# Altium schematic sheet CT Main.SchDoc
size A3
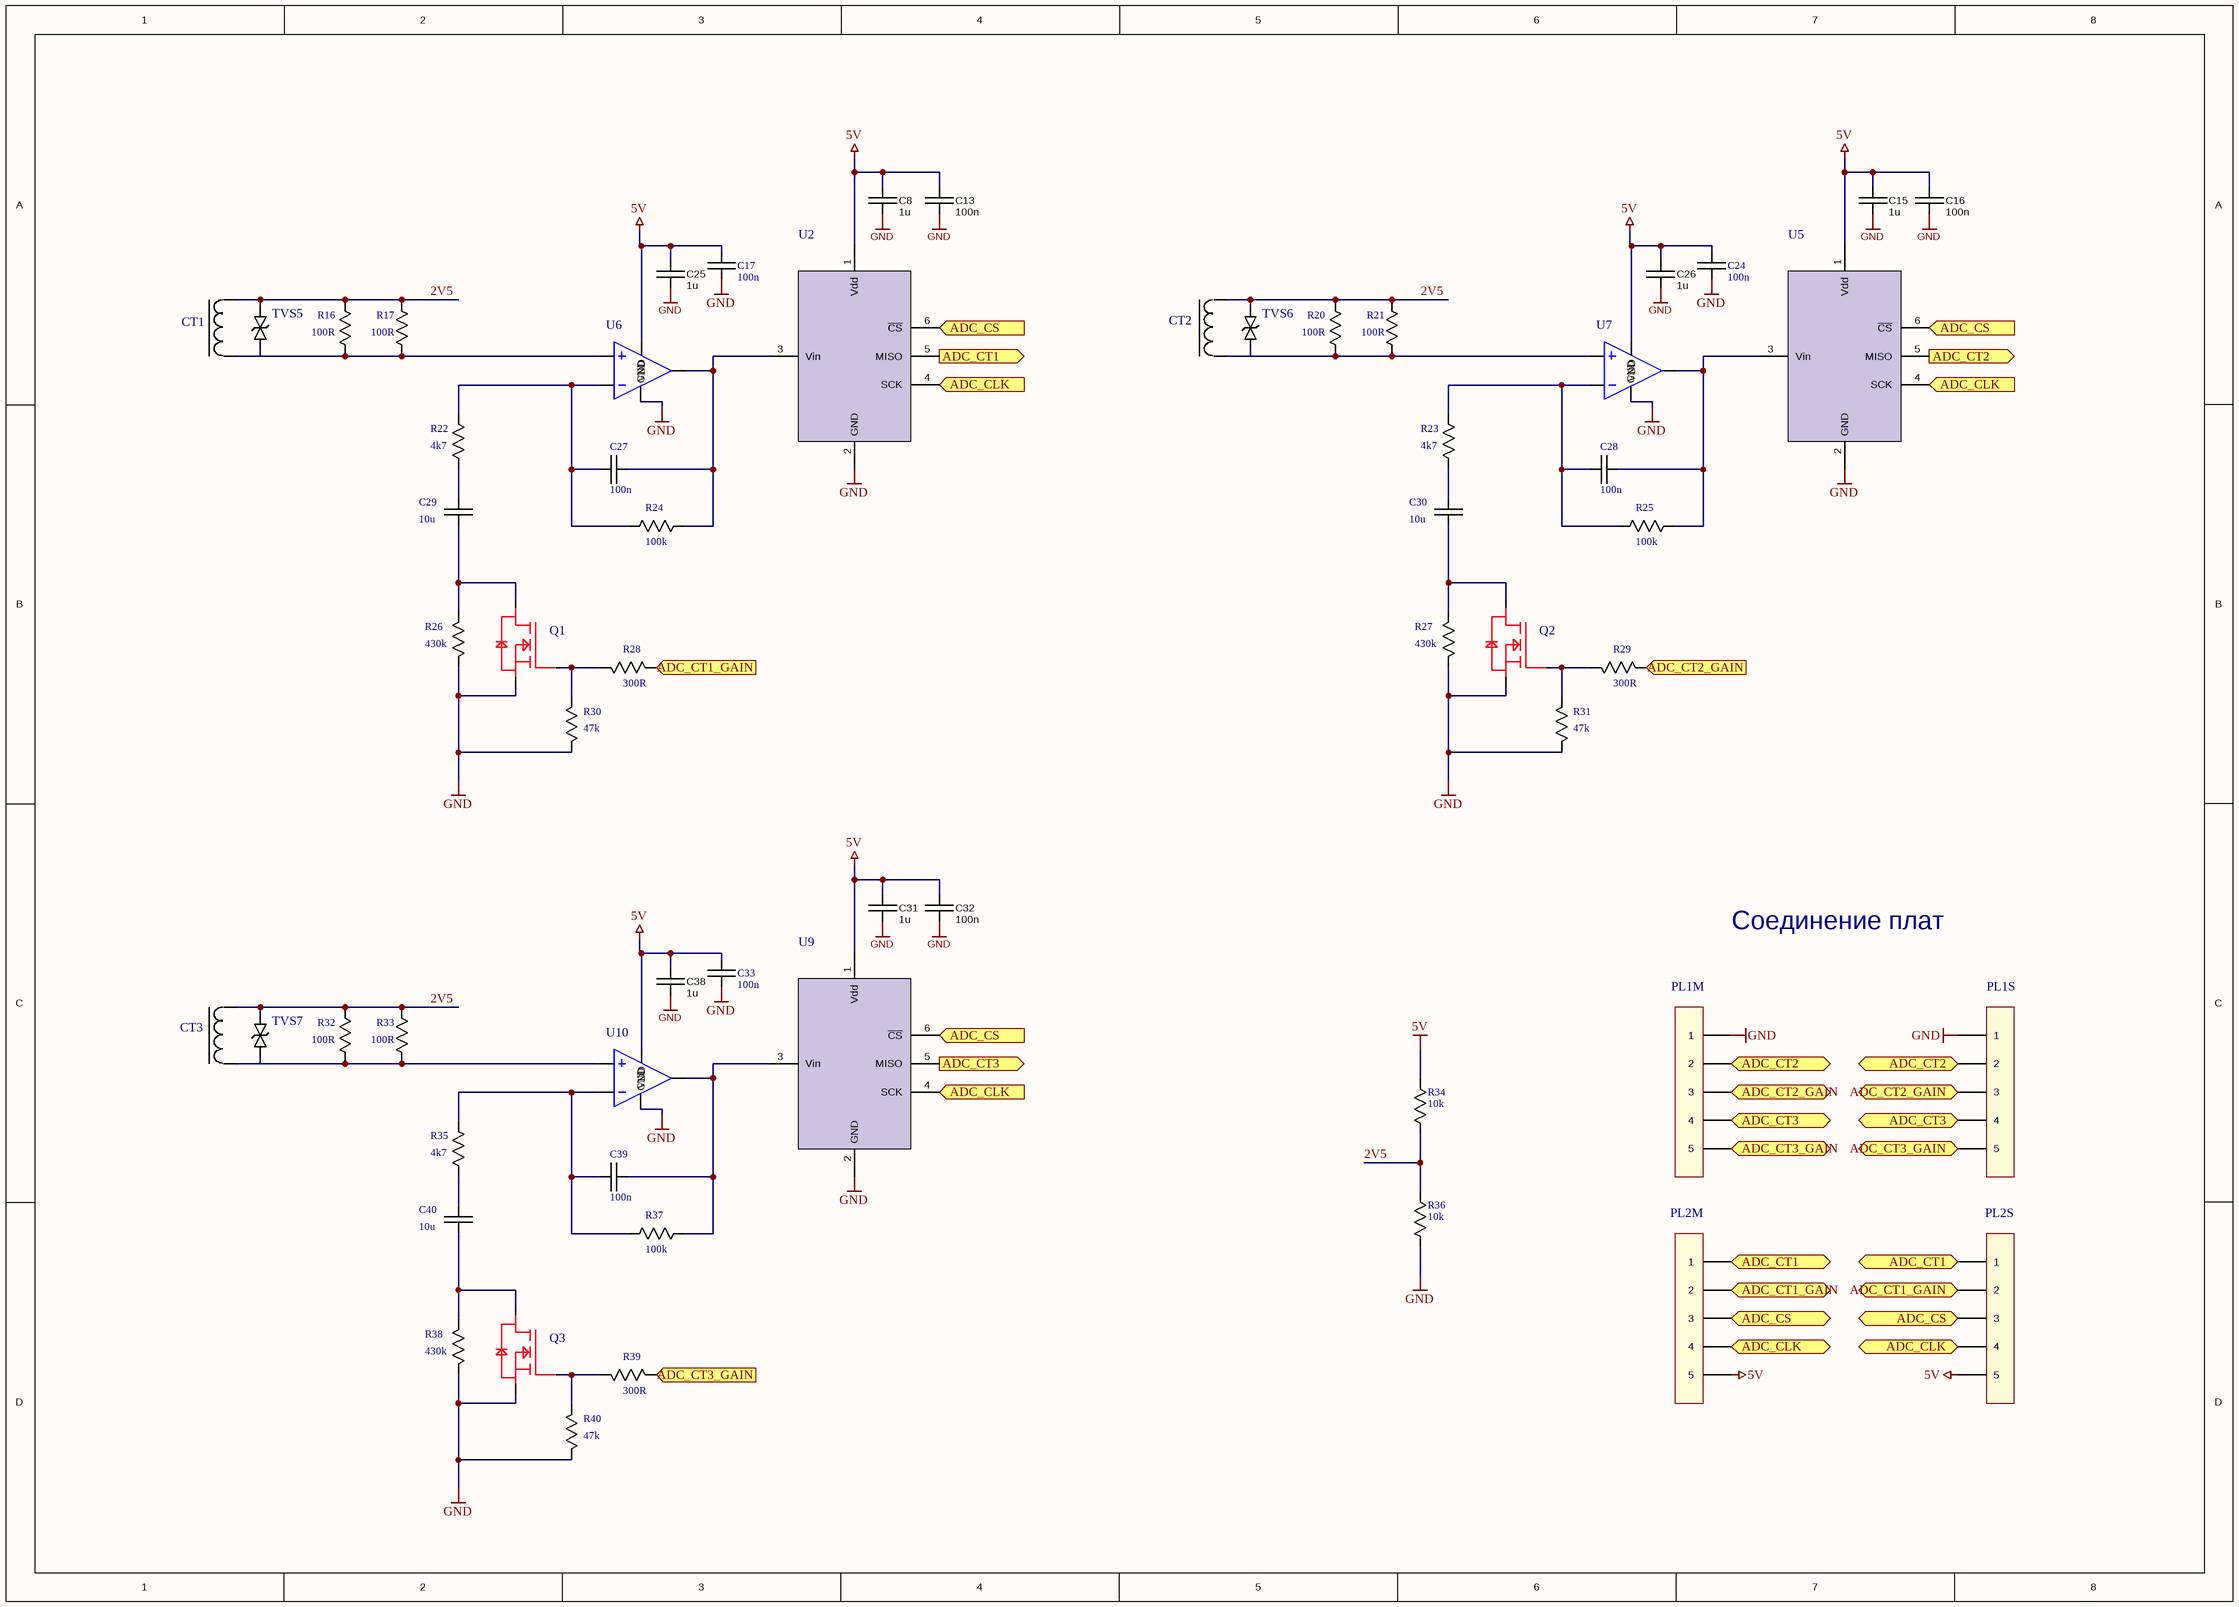
[diagram p0: CT Main.SchDoc]

## Parts
C8  1u  [CAP CER 0603 NP]
C13  100n  [CAP CER 0603 NP]
C15  1u  [CAP CER 0603 NP]
C16  100n  [CAP CER 0603 NP]
C17  100n  [0603]
C24  100n  [0603]
C25  1u  [CAP CER 0603 NP]
C26  1u  [CAP CER 0603 NP]
C27  100n  [0603]
C28  100n  [0603]
C29  10u  [0603]
C30  10u  [0603]
C31  1u  [CAP CER 0603 NP]
C32  100n  [CAP CER 0603 NP]
C33  100n  [0603]
C38  1u  [CAP CER 0603 NP]
C39  100n  [0603]
C40  10u  [0603]
CT1  Current Transformer  [Talema AC1005]  (value not drawn)
CT2  Current Transformer  [Talema AC1005]  (value not drawn)
CT3  Current Transformer  [Talema AC1005]  (value not drawn)
PL1M  Pin Line  [PLS-5 2.54]  (value not drawn)  (no BOM)
PL1S  Pin Line  [PLS-5 2.54 - Part]  (value not drawn)
PL2M  Pin Line  [PLS-5 2.54]  (value not drawn)  (no BOM)
PL2S  Pin Line  [PLS-5 2.54 - Part]  (value not drawn)
Q1  MOSFET-N  [SOT23]  (value not drawn)
Q2  MOSFET-N  [SOT23]  (value not drawn)
Q3  MOSFET-N  [SOT23]  (value not drawn)
R16  100R  [1206]
R17  100R  [1206]
R20  100R  [1206]
R21  100R  [1206]
R22  4k7  [0603]
R23  4k7  [0603]
R24  100k  [0603]
R25  100k  [0603]
R26  430k  [0603]
R27  430k  [0603]
R28  300R  [0603]
R29  300R  [0603]
R30  47k  [0603]
R31  47k  [0603]
R32  100R  [1206]
R33  100R  [1206]
R34  10k  [0603]
R35  4k7  [0603]
R36  10k  [0603]
R37  100k  [0603]
R38  430k  [0603]
R39  300R  [0603]
R40  47k  [0603]
TVS5  TVS 5V  [DO-214AC]  (value not drawn)
TVS6  TVS 5V  [DO-214AC]  (value not drawn)
TVS7  TVS 5V  [DO-214AC]  (value not drawn)
U2  SAR ADC  [SOT23 - 6]  (value not drawn)
U5  SAR ADC  [SOT23 - 6]  (value not drawn)
U6  TS321ILT  [SOT235]  (value not drawn)
U7  TS321ILT  [SOT235]  (value not drawn)
U9  SAR ADC  [SOT23 - 6]  (value not drawn)
U10  TS321ILT  [SOT235]  (value not drawn)

## Ports
ADC_CLK, ADC_CS, ADC_CT1, ADC_CT1_GAIN, ADC_CT2, ADC_CT2_GAIN, ADC_CT3, ADC_CT3_GAIN

## Nets
5V: C8.1 C13.2 C15.1 C16.2 C17.2 C24.2 C25.1 C26.1 C31.1 C32.2 C33.2 C38.1 PL2M.5 PL2S.5 R34.1 U2.1(Vdd) U5.1(Vdd) U6.5(VDD) U7.5(VDD) U9.1(Vdd) U10.5(VDD)
GND: C8.2 C13.1 C15.2 C16.1 C17.1 C24.1 C25.2 C26.2 C31.2 C32.1 C33.1 C38.2 PL1M.1 PL1S.1 Q1.2 Q2.2 Q3.2 R26.1 R27.1 R30.1 R31.1 R36.2 R38.1 R40.1 U2.2(GND) U5.2(GND) U6.2(GND) U7.2(GND) U9.2(GND) U10.2(GND)
2V5: CT1.2 CT2.2 CT3.2 R16.2 R17.2 R20.2 R21.2 R32.2 R33.2 R34.2 R36.1 TVS5.2 TVS6.2 TVS7.2
ADC_CLK: PL2M.4 PL2S.4 U2.4(SCK) U5.4(SCK) U9.4(SCK) ; port ADC_CLK
ADC_CS: PL2M.3 PL2S.3 U2.6(~{CS}) U5.6(~{CS}) U9.6(~{CS}) ; port ADC_CS
ADC_CT1: PL2M.1 PL2S.1 U2.5(MISO) ; port ADC_CT1
ADC_CT1_GAIN: PL2M.2 PL2S.2 R28.1 ; port ADC_CT1_GAIN
ADC_CT2: PL1M.2 PL1S.2 U5.5(MISO) ; port ADC_CT2
ADC_CT2_GAIN: PL1M.3 PL1S.3 R29.1 ; port ADC_CT2_GAIN
ADC_CT3: PL1M.4 PL1S.4 U9.5(MISO) ; port ADC_CT3
ADC_CT3_GAIN: PL1M.5 PL1S.5 R39.1 ; port ADC_CT3_GAIN
NetC27_1: C27.1 R22.2 R24.1 U6.4(-IN)
NetC27_2: C27.2 R24.2 U2.3(Vin) U6.1(OUT)
NetC28_1: C28.1 R23.2 R25.1 U7.4(-IN)
NetC28_2: C28.2 R25.2 U5.3(Vin) U7.1(OUT)
NetC29_1: C29.1 Q1.3 R26.2
NetC29_2: C29.2 R22.1
NetC30_1: C30.1 Q2.3 R27.2
NetC30_2: C30.2 R23.1
NetC39_1: C39.1 R35.2 R37.1 U10.4(-IN)
NetC39_2: C39.2 R37.2 U9.3(Vin) U10.1(OUT)
NetC40_1: C40.1 Q3.3 R38.2
NetC40_2: C40.2 R35.1
NetCT1_1: CT1.1 R16.1 R17.1 TVS5.1 U6.3(+IN)
NetCT2_1: CT2.1 R20.1 R21.1 TVS6.1 U7.3(+IN)
NetCT3_1: CT3.1 R32.1 R33.1 TVS7.1 U10.3(+IN)
NetQ1_1: Q1.1 R28.2 R30.2
NetQ2_1: Q2.1 R29.2 R31.2
NetQ3_1: Q3.1 R39.2 R40.2

## Notes on the sheet
- Соединение плат

## Library data of the parts
C8 C15 C25 C26 C31 C38 = Capacitor: CC0603KRX5R7BB105
C13 C16 C17 C24 C27 C28 C32 C33 C39 = Capacitor: CC0603KRX7R9BB104
C29 C30 C40 = Capacitor: GRM188R61C106MA73D
CT1-CT3 = Current Trans: AC-1005
PL1M PL1S PL2M PL2S = PLS-5: PLS-5 2.54
Q1-Q3 = IRLML: IRLML2502TR
R16 R17 R20 R21 R32 R33 = Resistor: RT1206BRD07100RL
R22 R23 R35 = Resistor: RC0603FR-074K7L
R24 R25 R37 = Resistor: RC0603FR-07100KL
R26 R27 R38 = Resistor: RC0603FR-07430KL
R28 R29 R39 = Resistor: RC0603FR-07300RL
R30 R31 R40 = Resistor: RC0603FR-0747KL
R34 R36 = Resistor: RC0603FR-0710KL
TVS5-TVS7 = SMAJ5.0CA
U2 U5 U9 = ADC121: ADC121S021CIMF
U6 U7 U10 = OPAMP